# EAGLE schematic bankswitch-reg (EAGLE 7.0.0)
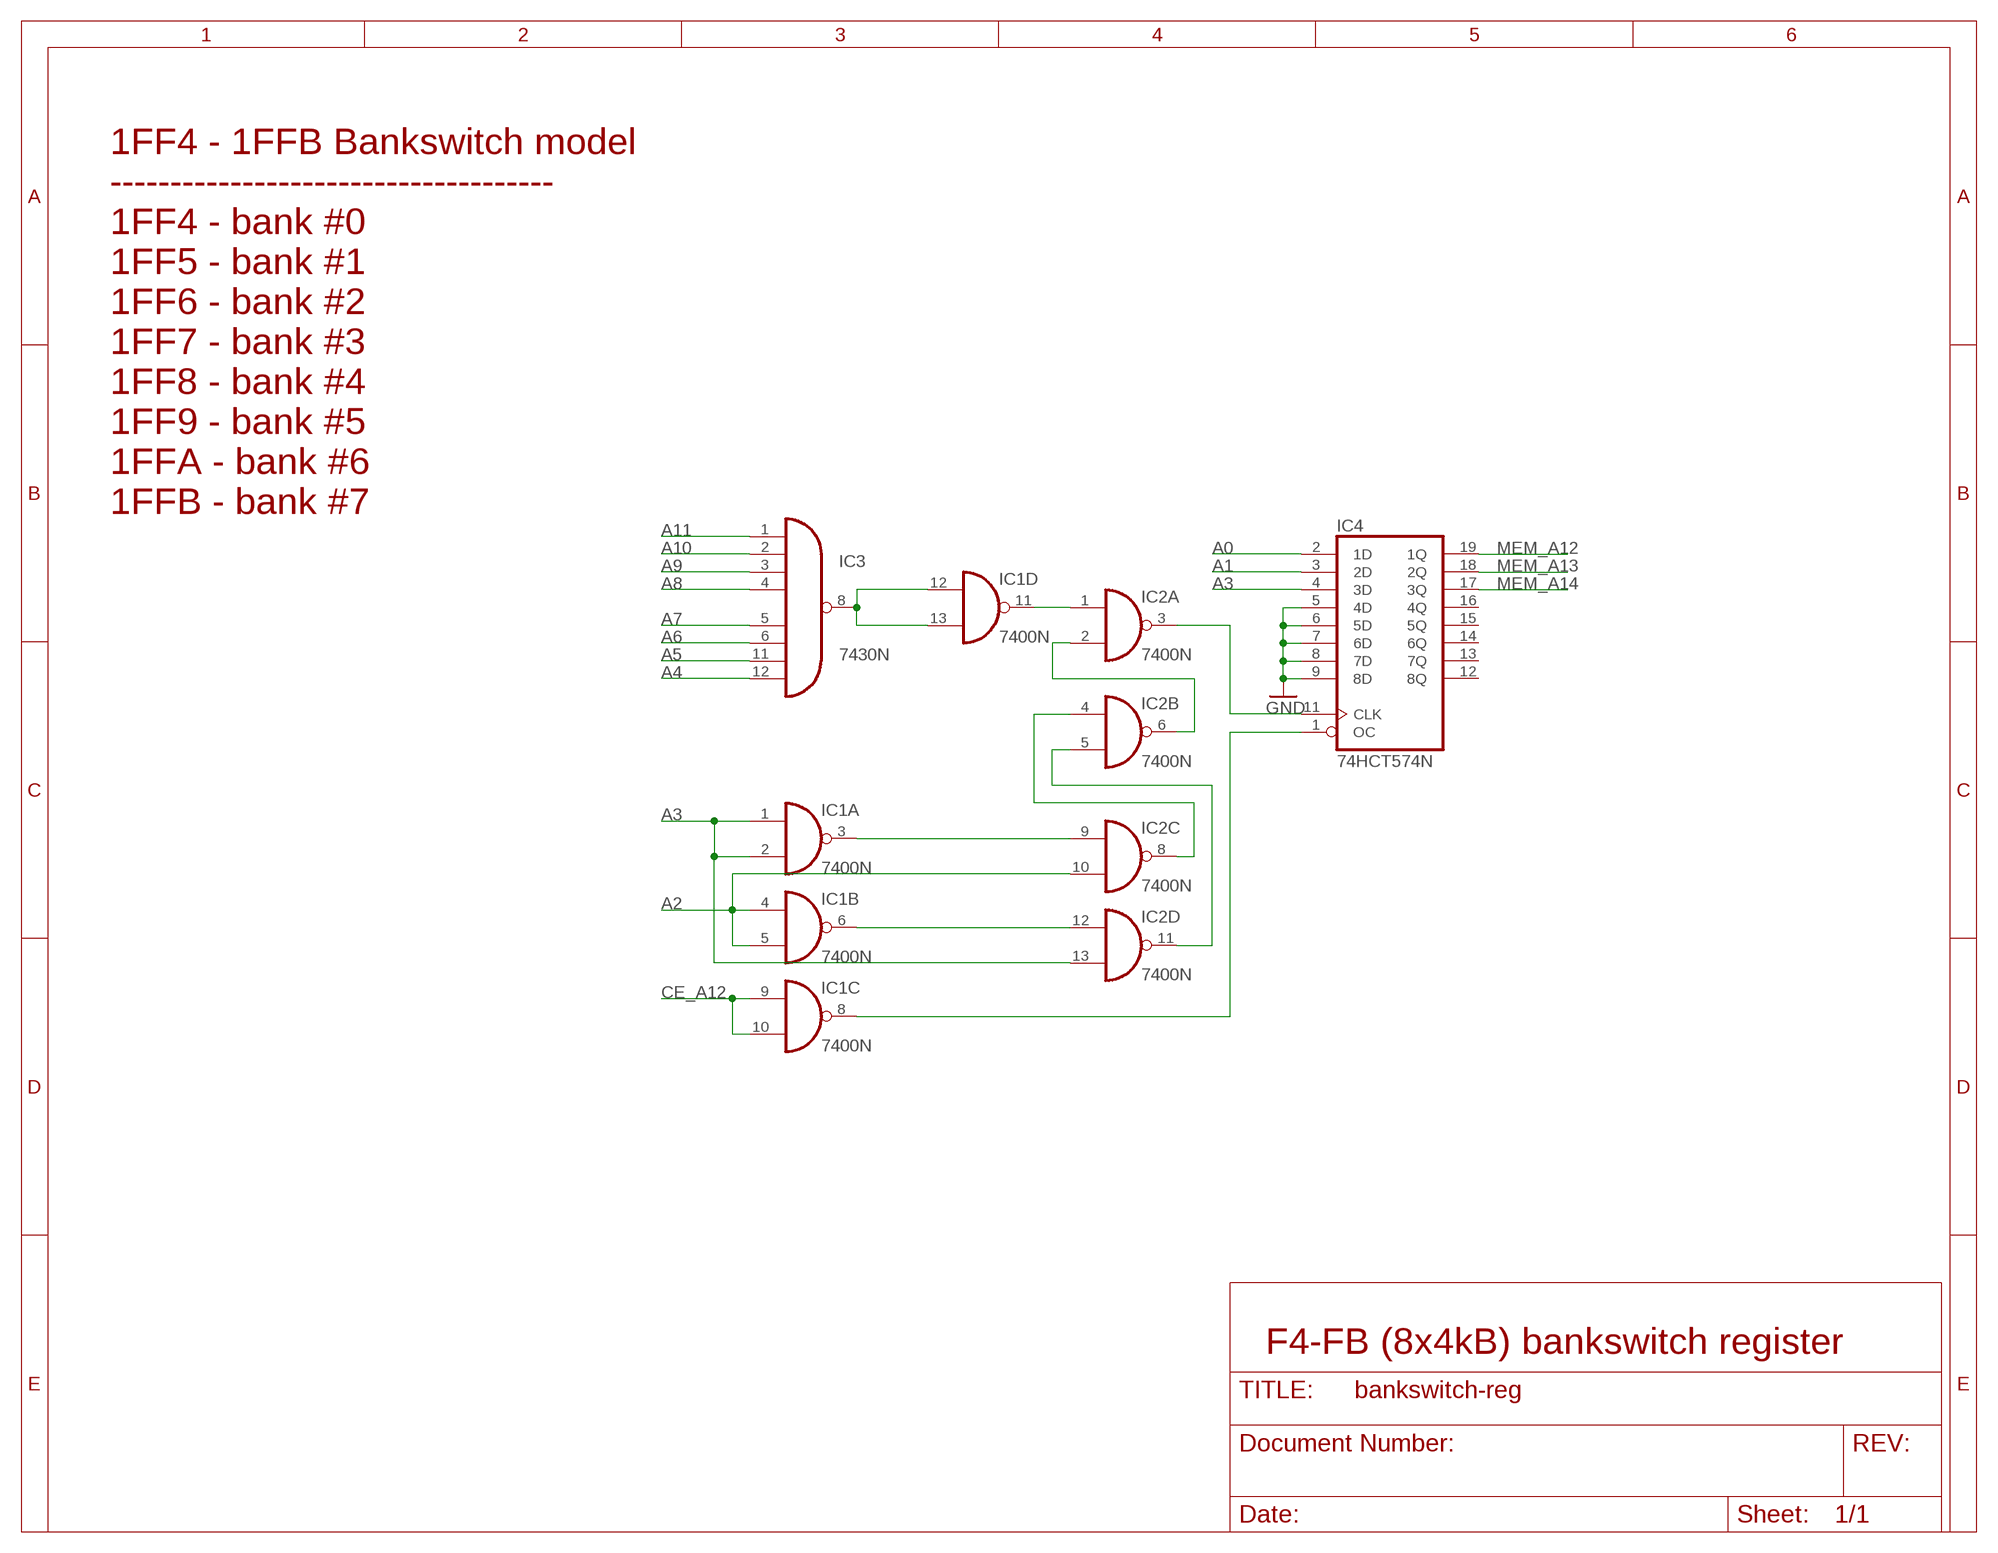
[diagram p0: schematic, sheet 1]
FRAME1 (FRAME_A_L): HEAD: F4-FB (8x4kB) bankswitch register

## Parts
IC1  7400N  [DIL14]
IC2  7400N  [DIL14]
IC3  7430N  [DIL14]
IC4  74HCT574N  [DIL20]

## Nets
A0: IC4.2(1D)
A1: IC4.3(2D)
A2: IC1.4(B:I0) IC1.5(B:I1) IC2.10(C:I1)
A3: IC1.1(A:I0) IC1.2(A:I1) IC2.13(D:I1) IC4.4(3D)
A4: IC3.12(I7)
A5: IC3.11(I6)
A6: IC3.6(I5)
A7: IC3.5(I4)
A8: IC3.4(I3)
A9: IC3.3(I2)
A10: IC3.2(I1)
A11: IC3.1(I0)
CE_A12: IC1.9(C:I0) IC1.10(C:I1)
GND: IC4.5(4D) IC4.6(5D) IC4.7(6D) IC4.8(7D) IC4.9(8D)
MEM_A12: IC4.19(1Q)
MEM_A13: IC4.18(2Q)
MEM_A14: IC4.17(3Q)
N$1: IC1.11(D:O) IC2.1(A:I0)
N$2: IC1.12(D:I0) IC1.13(D:I1) IC3.8(O)
N$4: IC2.3(A:O) IC4.11(CLK)
N$5: IC2.2(A:I1) IC2.6(B:O)
N$7: IC2.4(B:I0) IC2.8(C:O)
N$8: IC2.5(B:I1) IC2.11(D:O)
N$9: IC1.3(A:O) IC2.9(C:I0)
N$10: IC1.8(C:O) IC4.1(OC)
N$12: IC1.6(B:O) IC2.12(D:I0)
Unconnected: IC4.12(8Q) IC4.13(7Q) IC4.14(6Q) IC4.15(5Q) IC4.16(4Q)

## Notes on the sheet
- 1FF4 - 1FFB Bankswitch model
  -------------------------------------
  1FF4 - bank #0
  1FF5 - bank #1
  1FF6 - bank #2
  1FF7 - bank #3
  1FF8 - bank #4
  1FF9 - bank #5
  1FFA - bank #6
  1FFB - bank #7

## Power pins joined to a net without a drawn wire
GND: IC1.7(P:GND) IC2.7(P:GND) IC3.7(GND) IC4.10(GND)
VCC: IC1.14(P:VCC) IC2.14(P:VCC) IC3.14(VCC) IC4.20(VCC)

## Library data of the parts
IC1 IC2 = 74xx-eu:74*00: Quad 2-input NAND gate
IC3 = 74xx-eu:74*30: 8-input NAND gate
IC4 = 74xx-eu:74*574: 8-bit D type FLIP FLOP bus driver